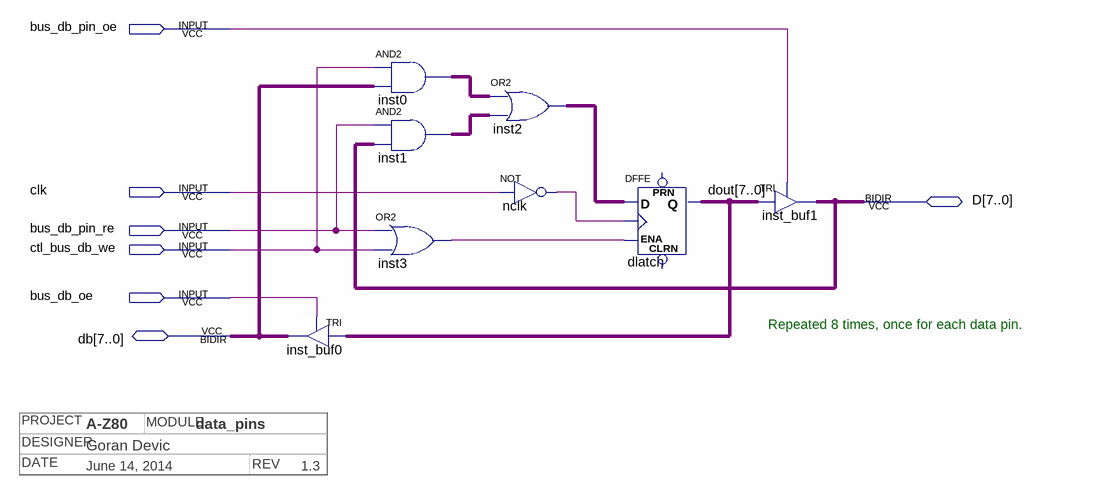
[diagram p0: schematic sheet]
// Quartus schematic data_pins.bdf as structural Verilog: 8 symbols, 7 pins
// Title block: PROJECT: A-Z80; MODULE: data_pins; DESIGNER: Goran Devic; DATE: June 14, 2014; REV: 1.3
module data_pins (
  input  bus_db_pin_oe,
  input  clk,
  input  bus_db_pin_re,
  input  ctl_bus_db_we,
  input  bus_db_oe,
  inout  [7:0] D,
  inout  [7:0] db
);

  wire inst3_out, nclk_out;
  wire [7:0] dout, inst0_out, inst1_out, inst2_out;

  TRI inst_buf0[7:0] (.IN(dout), .OE(bus_db_oe), .OUT(db));
  assign inst0_out = {8{ctl_bus_db_we}} & db;  // AND2 inst0, 8 bits wide
  assign inst1_out = {8{bus_db_pin_re}} & D;  // AND2 inst1, 8 bits wide
  or inst3 (inst3_out, bus_db_pin_re, ctl_bus_db_we);
  assign inst2_out = inst0_out | inst1_out;  // OR2 inst2, 8 bits wide
  not nclk (nclk_out, clk);
  DFFE dlatch[7:0] (.D(inst2_out), .CLK(nclk_out), .ENA(inst3_out), .Q(dout));  // open: PRN, CLRN
  TRI inst_buf1[7:0] (.IN(dout), .OE(bus_db_pin_oe), .OUT(D));

  // Notes on the sheet:
  //   Repeated 8 times, once for each data pin.
endmodule
